# Altium schematic sheet STM8S103.SchDoc
size A4
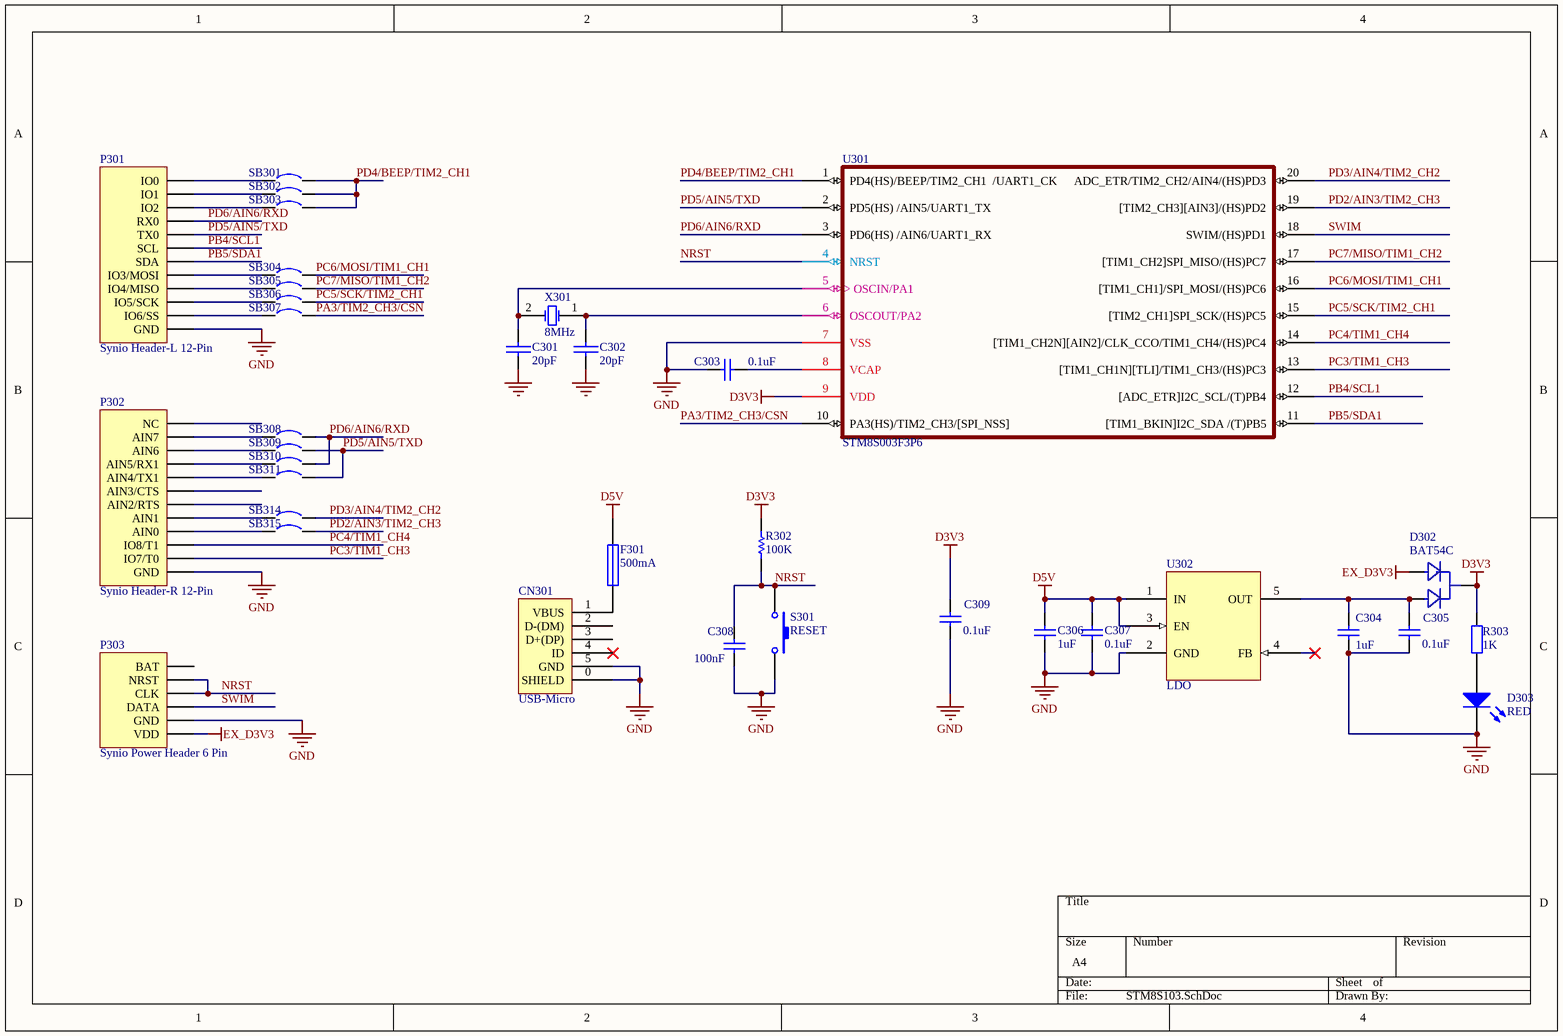
[diagram p0: STM8S103.SchDoc]

## Parts
C301  20pF  [0603M]
C302  20pF  [0603M]
C303  0.1uF  [C0603L]
C304  1uF  [0603M]
C305  0.1uF  [0603M]
C306  value 1uF  [C0603L]  (hidden comment: Cap)
C307  value 0.1uF  [C0603L]  (hidden comment: Cap)
C308  100nF  [0603M]
C309  0.1uF  [0603M]
CN301  USB-Micro  [USB-MICRO-Female-Lite]
D302  BAT54C  [BAT54C]
D303  RED  [0603pn]
F301  500mA  [0805]
P301  Synio Header-L 12-Pin  [HDR1X12]
P302  Synio Header-R 12-Pin  [HDR1X12]
P303  Synio Power Header 6 Pin  [HDR1X6/2.54MM]
R302  100K  [0603M]
R303  1K  [0603M]
S301  RESET  [KEY-2x4-SMD]
SB301  Circuit Breaker  [JP2_SMD]  (value not drawn)
SB302  Circuit Breaker  [JP2_SMD]  (value not drawn)
SB303  Circuit Breaker  [JP2_SMD]  (value not drawn)
SB304  Circuit Breaker  [JP2_SMD]  (value not drawn)
SB305  Circuit Breaker  [JP2_SMD]  (value not drawn)
SB306  Circuit Breaker  [JP2_SMD]  (value not drawn)
SB307  Circuit Breaker  [JP2_SMD]  (value not drawn)
SB308  Circuit Breaker  [JP2_SMD]  (value not drawn)
SB309  Circuit Breaker  [JP2_SMD]  (value not drawn)
SB310  Circuit Breaker  [JP2_SMD]  (value not drawn)
SB311  Circuit Breaker  [JP2_SMD]  (value not drawn)
SB314  Circuit Breaker  [JP2_SMD]  (value not drawn)
SB315  Circuit Breaker  [JP2_SMD]  (value not drawn)
U301  STM8S003F3P6  [TSSOP20]
U302  LDO  [SOT23-5]
X301  8MHz  [XTAL_49S]

## Nets
D3V3: C309.2 D302.3 R302.2 R303.2 U301.9(VDD)
D5V: C306.2 C307.2 F301.1 U302.1(IN) U302.3(EN)
EX_D3V3: D302.1 P303.1(VDD)
GND: C301.2 C302.2 C303.2 C304.1 C305.1 C306.1 C307.1 C308.1 C309.1 CN301.0(SHIELD) CN301.5(GND) D303.2(K) P301.1(GND) P302.1(GND) P303.2(GND) S301.1 U301.7(VSS) U302.2(GND)
NRST: C308.2 P303.4(CLK) P303.5(NRST) R302.1 S301.2 U301.4(NRST)
PA3/TIM2_CH3/CSN: SB307.2 U301.10(PA3(HS)/TIM2_CH3/[SPI_NSS])
PB4/SCL1: P301.7(SCL) U301.12([ADC_ETR]I2C_SCL/(T)PB4)
PB5/SDA1: P301.6(SDA) U301.11([TIM1_BKIN]I2C_SDA_/(T)PB5)
PC3/TIM1_CH3: P302.2(IO7/T0) U301.13([TIM1_CH1N][TLI]/TIM1_CH3/(HS)PC3)
PC4/TIM1_CH4: P302.3(IO8/T1) U301.14([TIM1_CH2N][AIN2]/CLK_CCO/TIM1_CH4/(HS)PC4)
PC5/SCK/TIM2_CH1: SB306.2 U301.15([TIM2_CH1]SPI_SCK/(HS)PC5)
PC6/MOSI/TIM1_CH1: SB304.2 U301.16([TIM1_CH1]/SPI_MOSI/(HS)PC6)
PC7/MISO/TIM1_CH2: SB305.2 U301.17([TIM1_CH2]SPI_MISO/(HS)PC7)
PD2/AIN3/TIM2_CH3: SB315.2 U301.19([TIM2_CH3][AIN3]/(HS)PD2)
PD3/AIN4/TIM2_CH2: SB314.2 U301.20(ADC_ETR/TIM2_CH2/AIN4/(HS)PD3)
PD4/BEEP/TIM2_CH1: SB301.2 SB302.2 SB303.2 U301.1(PD4(HS)/BEEP/TIM2_CH1__/UART1_CK)
PD5/AIN5/TXD: P301.8(TX0) SB309.2 SB311.2 U301.2(PD5(HS)_/AIN5/UART1_TX)
PD6/AIN6/RXD: P301.9(RX0) SB308.2 SB310.2 U301.3(PD6(HS)_/AIN6/UART1_RX)
SWIM: P303.3(DATA) U301.18(SWIM/(HS)PD1)
NetC301_1: C301.1 U301.5(OSCIN/PA1) X301.2(OSC2)
NetC302_1: C302.1 U301.6(OSCOUT/PA2) X301.1(OSC1)
NetC303_1: C303.1 U301.8(VCAP)
NetC304_2: C304.2 C305.2 D302.2 U302.5(OUT)
NetCN301_1: CN301.1(VBUS) F301.2
NetD303_1: D303.1(A) R303.1
NetP301_2: P301.2(IO6/SS) SB307.1
NetP301_3: P301.3(IO5/SCK) SB306.1
NetP301_4: P301.4(IO4/MISO) SB305.1
NetP301_5: P301.5(IO3/MOSI) SB304.1
NetP301_10: P301.10(IO2) SB303.1
NetP301_11: P301.11(IO1) SB302.1
NetP301_12: P301.12(IO0) SB301.1
NetP302_4: P302.4(AIN0) SB315.1
NetP302_5: P302.5(AIN1) SB314.1
NetP302_8: P302.8(AIN4/TX1) SB311.1
NetP302_9: P302.9(AIN5/RX1) SB310.1
NetP302_10: P302.10(AIN6) SB309.1
NetP302_11: P302.11(AIN7) SB308.1

Not connected (* = marked no-connect by the designer): CN301 2(D-(DM)) 3(D+(DP)) 4(ID)*; P302 6(AIN2/RTS) 7(AIN3/CTS) 12(NC); P303 6(BAT); U302 4(FB)*

## Library data of the parts
C301 C302 = CAP: Capacitor; Fitted: NO
C303-C307 C309 = Cap: Capacitor; Published: 8-Jun-2000; LatestRevisionDate: 17-Jul-2002; LatestRevisionNote: Re-released for DXP Platform.; PackageReference: RAD-0.3
  C303 C305 C309: Value: 0.1uF
  C304: Value: 1uF
  C306 C307: Publisher: Altium Limited
C308 = CAP: Capacitor; Published: 8-Jun-2000; Revision: July-2002: Re-released for DXP Platform.; Publisher: Altium Limited; Value: 100nF
D302 = BAT54C: DOUBLE SHOTTKEY DIODES
D303 = LED0: Typical INFRARED GaAs LED; Published: 8-Jun-2000; LatestRevisionDate: 08-Jul-2005; LatestRevisionNote: Mech Layer 1 removed.; PackageReference: LED-0; Publisher: Altium Limited
F301 = Fuse 1: Fuse; Published: 8-Jun-2000; LatestRevisionDate: 17-Jul-2002; LatestRevisionNote: Re-released for DXP Platform.; PackageReference: PIN-W2/E2.8; Publisher: Altium Limited; PackageDescription: Thru-Hole; 2 Leads
P301 = Synio Header-L 12-Pin: Synio Header-L, 12-Pin; LatestRevisionDate: 17-Jul-2002; LatestRevisionNote: Re-released for DXP Platform.; Publisher: Altium Limited
P302 = Synio Header-R 12-Pin: Synio Header-R, 12-Pin; LatestRevisionDate: 17-Jul-2002; LatestRevisionNote: Re-released for DXP Platform.; Publisher: Altium Limited
R302 = res1: Resistor; Fitted: NO; Published: 8-Jun-2000; Revision: July-2002: Re-released for DXP Platform.; Publisher: Altium Limited; Value: 100K
R303 = Res2: Resistor; Published: 8-Jun-2000; LatestRevisionDate: 17-Jul-2002; LatestRevisionNote: Re-released for DXP Platform.; PackageReference: AXIAL-0.4; Publisher: Altium Limited; Value: 1K
S301 = SW-PB: Switch; Published: 24-Mar-1999; LatestRevisionDate: 17-Jul-2002; LatestRevisionNote: Re-released for DXP Platform.; PackageReference: SPST-2; Publisher: Altium Limited
SB301-SB311 SB314 SB315 = Circuit Breaker: Solder: YES; Published: 24-Mar-1999; Revision: July-2002: Re-released for DXP Platform.; Publisher: Altium Limited
U301 = STM8S103F2P6: ST 8-bit  Microcontroller
U302 = LDO-SOT23-5: General LDO SOT23-5
X301 = XTAL: Crystal Oscillator; Fitted: NO; Published: 8-Jun-2000; LatestRevisionDate: 17-Jul-2002; LatestRevisionNote: Re-released for DXP Platform.; PackageReference: R38; Publisher: Altium Limited